# EAGLE design bldc servo controller v1 (EAGLE 9.4.2)
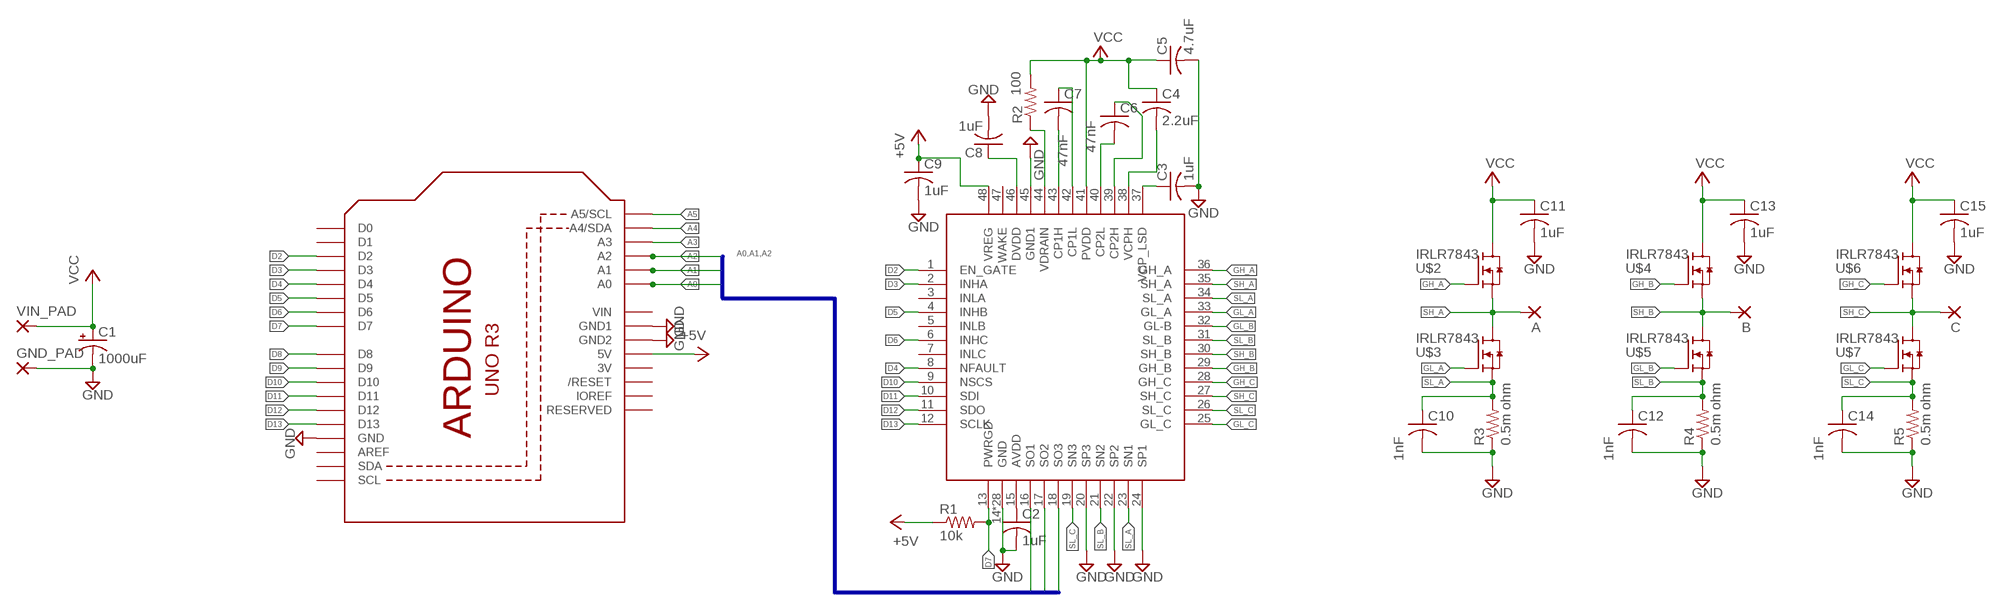
[diagram p0: schematic, sheet 1]

## Parts
A  WIREPAD1,6/0,8  [1,6/0,8]
B  WIREPAD1,6/0,8  [1,6/0,8]
C  WIREPAD1,6/0,8  [1,6/0,8]
C1  1000uF  CPOL-USE3.5-10  [E3,5-10]
C2  1uF  C-USC0805  [C0805]
C3  1uF  C-USC0805  [C0805]
C4  2.2uF  C-USC0805  [C0805]
C5  4.7uF  C-USC0805  [C0805]
C6  47nF  C-USC0805  [C0805]
C7  47nF  C-USC0805  [C0805]
C8  1uF  C-USC0805  [C0805]
C9  1uF  C-USC0805  [C0805]
C10  1nF  C-USC0805  [C0805]
C11  1uF  C-USC0805  [C0805]
C12  1nF  C-USC0805  [C0805]
C13  1uF  C-USC0805  [C0805]
C14  1nF  C-USC0805  [C0805]
C15  1uF  C-USC0805  [C0805]
GND_PAD  WIREPAD1,6/0,8  [1,6/0,8]
R1  10k  R-US_M0805  [M0805]
R2  100  R-US_M0805  [M0805]
R3  0.5m ohm  R-US_R2512  [R2512]
R4  0.5m ohm  R-US_R2512  [R2512]
R5  0.5m ohm  R-US_R2512  [R2512]
U1  ARDUINOR3-BPLACE  [ARDUINOR3-BPLACE]
U$1  DRV8305  [PFB_S-PQFP-G48]
U$2  IRLR7843  [TO252]
U$3  IRLR7843  [TO252]
U$4  IRLR7843  [TO252]
U$5  IRLR7843  [TO252]
U$6  IRLR7843  [TO252]
U$7  IRLR7843  [TO252]
VIN_PAD  WIREPAD1,6/0,8  [1,6/0,8]

## Nets
+5V: C9.1 R1.1 U1.5V U$1.48(VREG)
A0: U1.A0 U$1.16(SO1)
A1: U1.A1 U$1.17(SO2)
A2: U1.A2 U$1.18(SO3)
A3: U1.A3
A4: U1.A4(A4/SDA)
A5: U1.A5(A5/SCL)
D2: U1.D2 U$1.1(EN_GATE)
D3: U1.D3 U$1.2(INHA)
D4: U1.D4 U$1.8(NFAULT)
D5: U1.D5 U$1.4(INHB)
D6: U1.D6 U$1.6(INHC)
D7: R1.2 U1.D7 U$1.13(PWRGD)
D8: U1.D8
D9: U1.D9
D10: U1.D10 U$1.9(NSCS)
D11: U1.D11 U$1.10(SDI)
D12: U1.D12 U$1.11(SDO)
D13: U1.D13 U$1.12(SCLK)
GH_A: U$1.36(GH_A) U$2.1(G)
GH_B: U$1.29(GH_B) U$4.1(G)
GH_C: U$1.28(GH_C) U$6.1(G)
GL_A: U$1.33(GL_A) U$3.1(G)
GL_B: U$1.32(GL-B) U$5.1(G)
GL_C: U$1.25(GL_C) U$7.1(G)
GND: C1.- C2.2 C3.2 C5.2 C8.2 C9.2 C10.2 C11.2 C12.2 C13.2 C14.2 C15.2 GND_PAD.1(P) R3.1 R4.1 R5.1 U1.GND U1.GND1 U1.GND2 U$1.14(GND) U$1.20(SP3) U$1.22(SP2) U$1.24(SP1) U$1.45(GND1) U$1.P$1(GND) U$1.P$2(GND) U$1.P$3(GND) U$1.P$4(GND) U$1.P$5(GND) U$1.P$6(GND) U$1.P$7(GND) U$1.P$8(GND) U$1.P$9(GND) U$1.P$10(GND) U$1.P$11(GND) U$1.P$12(GND) U$1.P$13(GND) U$1.P$14(GND) U$1.P$15(GND) U$1.P$16(GND) U$1.P$17(GND) U$1.P$18(GND) U$1.P$19(GND) U$1.P$20(GND) U$1.P$21(GND) U$1.P$22(GND) U$1.P$23(GND) U$1.P$24(GND) U$1.P$25(GND) U$1.P$26(GND) U$1.P$27(GND)
N$1: C2.1 U$1.15(AVDD)
N$2: C3.1 U$1.37(VCP_LSD)
N$3: C4.2 U$1.38(VCPH)
N$4: C6.2 U$1.40(CP2L)
N$5: C6.1 U$1.39(CP2H)
N$6: C7.2 U$1.43(CP1H)
N$7: C7.1 U$1.42(CP1L)
N$8: R2.1 U$1.44(VDRAIN)
N$9: C8.1 U$1.46(DVDD)
SH_A: A.1(P) U$1.35(SH_A) U$2.2(S) U$3.3(D)
SH_B: B.1(P) U$1.30(SH_B) U$4.2(S) U$5.3(D)
SH_C: C.1(P) U$1.27(SH_C) U$6.2(S) U$7.3(D)
SL_A: C10.1 R3.2 U$1.23(SN1) U$1.34(SL_A) U$3.2(S)
SL_B: C12.1 R4.2 U$1.21(SN2) U$1.31(SL_B) U$5.2(S)
SL_C: C14.1 R5.2 U$1.19(SN3) U$1.26(SL_C) U$7.2(S)
VCC: C1.+ C4.1 C5.1 C11.1 C13.1 C15.1 R2.2 U$1.41(PVDD) U$2.3(D) U$4.3(D) U$6.3(D) VIN_PAD.1(P)
Unconnected: U1.AREF U1.D0 U1.D1 U1.IOREF U1.RESERVED U1.RESET(/RESET) U1.SCL U1.SDA U$1.3(INLA) U$1.5(INLB) U$1.7(INLC) U$1.47(WAKE)

## Buses
A0,A1,A2

## Power pins joined to a net without a drawn wire
3V: U1.3V
VIN: U1.VIN

## Library data of the parts
A B C GND_PAD VIN_PAD = wirepad:WIREPAD: Wire PAD connect wire on PCB
C1 = rcl:CPOL-US: POLARIZED CAPACITOR, American symbol; SPICEPREFIX: C
C2-C15 = rcl:C-US: CAPACITOR, American symbol; SPICEPREFIX: C
R1-R5 = rcl:R-US_: RESISTOR, American symbol; SPICEPREFIX: R
U1 = adafruit:ARDUINOR3: This is a new object for the new Arduino R3 - with extra pins that you may want to use (such as IOref, and duplicated A4/A5
U$1 = BLDC project:DRV8305
U$2-U$7 = BLDC project:IRLR7843

## Board
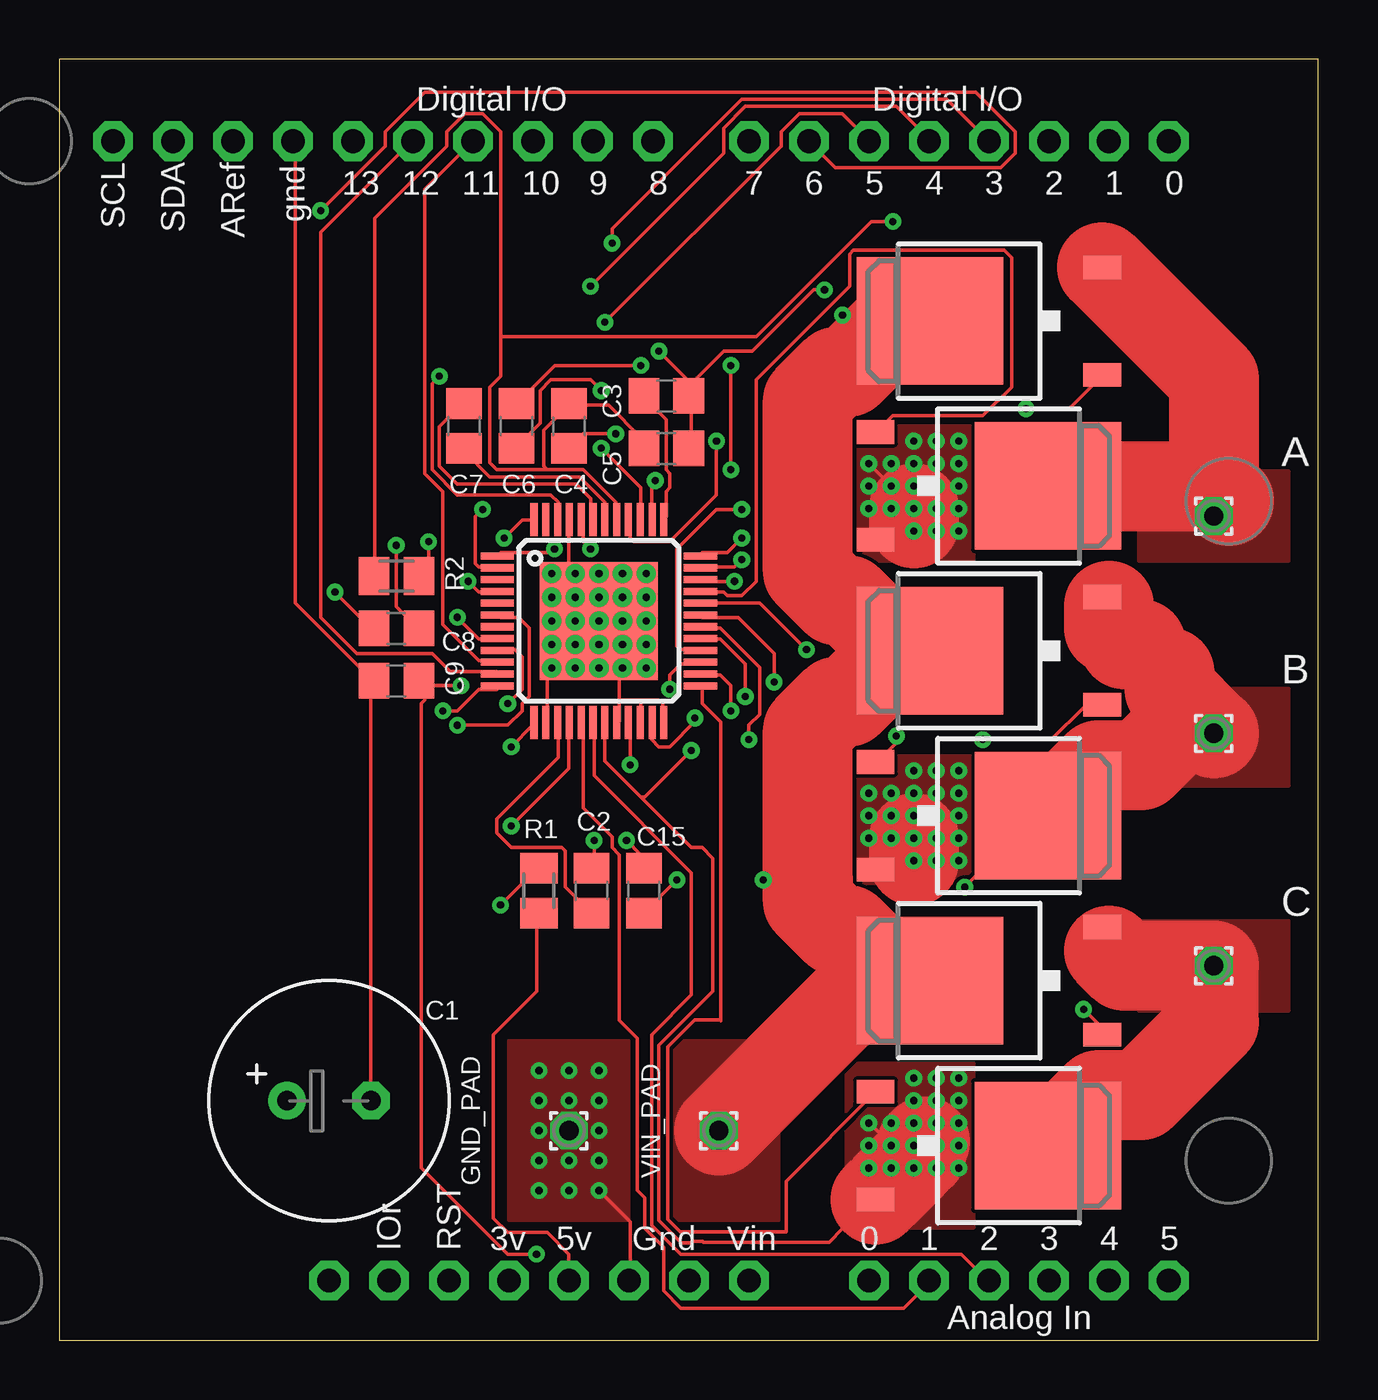
[diagram p1: board, top side]
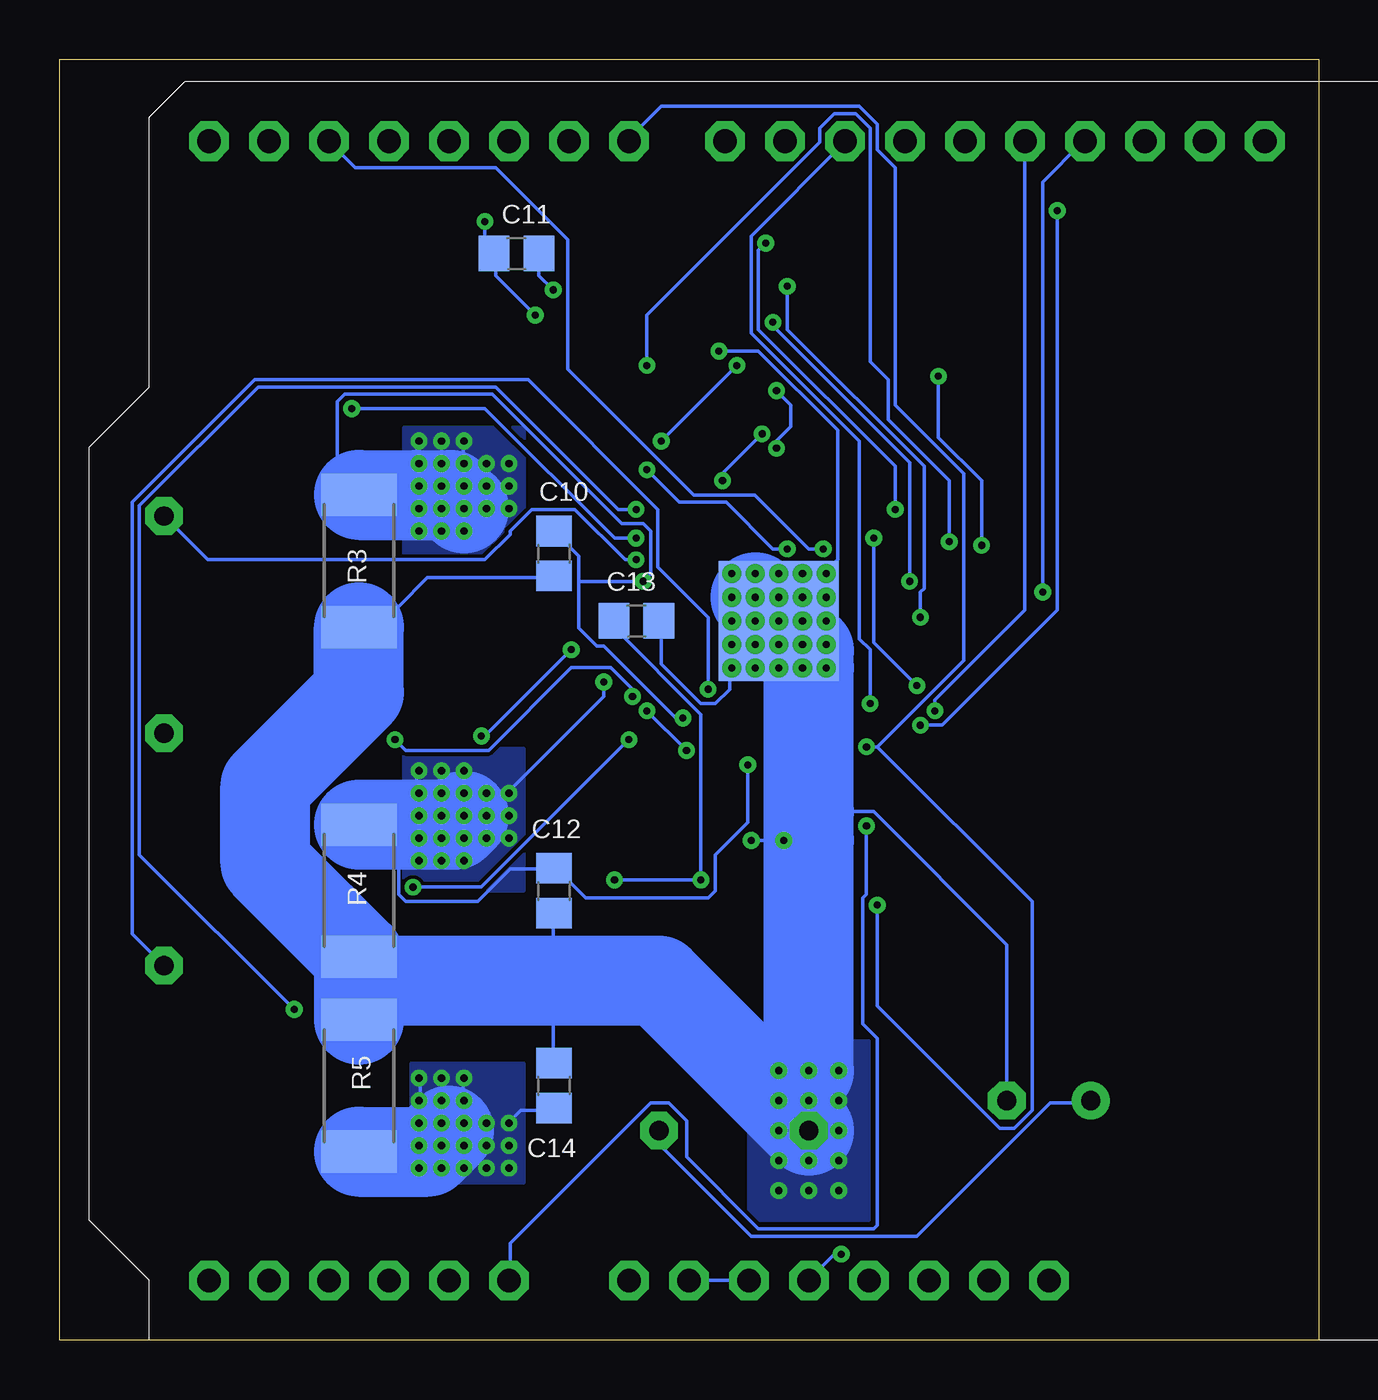
[diagram p2: board, bottom side, seen from below]

Size 53.32 x 54.28 mm. Coordinates in mm from the lower left corner, seen from the top.
Outline: 0,0 53.32,0 53.32,54.28 0,54.28 0,0
Copper layers (1*16): Top 0.035mm / dielectric 1.5mm / Bottom 0.035mm
Design rules "default *": minimum track width 6mil, minimum drill 0.3mm, track to track 6mil, track to pad 6mil, pad to pad 6mil, via to via 6mil, smd to smd 6mil, copper to edge 10mil, drill to drill 6mil, minimum pad ring 10mil, minimum via ring 8mil, stop-mask expansion 4mil, vias tented up to drill 1mm, thermal gap 0mil

### Footprints (pad centres in the part's own frame; a part is rotated, then mirrored left to right if it is on the bottom)
1,6/0,8 = drill 0.813 pad 1.6 octagon: 1 0,0
E3,5-10 = drill 0.813 pad 1.6: + -1.778,0 | drill 0.813 pad 1.6 octagon: - 1.778,0
C0805 = smd 1.3 x 1.5: 1 -0.95,0; 2 0.95,0
M0805 = smd 1.3 x 1.6: 1 -0.95,0; 2 0.95,0
R2512 = smd 1.8 x 3.2: 1 -2.8,0; 2 2.8,0
ARDUINOR3-BPLACE = drill 1 pad 1.676 octagon: 3V 35.56,2.54; 5V 38.1,2.54; A0 50.8,2.54; A1 53.34,2.54; A2 55.88,2.54; A3 58.42,2.54; A4 60.96,2.54; A5 63.5,2.54; AREF 23.876,50.8; D0 63.5,50.8; D1 60.96,50.8; D2 58.42,50.8; D3 55.88,50.8; D4 53.34,50.8; D5 50.8,50.8; D6 48.26,50.8; D7 45.72,50.8; D8 41.656,50.8; D9 39.116,50.8; D10 36.576,50.8; D11 34.036,50.8; D12 31.496,50.8; D13 28.956,50.8; GND 26.416,50.8; GND1 43.18,2.54; GND2 40.64,2.54; IOREF 30.48,2.54; RESERVED 27.94,2.54; RESET 33.02,2.54; SCL 18.796,50.8; SDA 21.336,50.8; VIN 45.72,2.54
PFB_S-PQFP-G48 = smd 1.4 x 0.3: 1 -4.3,2.75; 2 -4.3,2.25; 3 -4.3,1.75; 4 -4.3,1.25; 5 -4.3,0.75; 6 -4.3,0.25; 7 -4.3,-0.25; 8 -4.3,-0.75; 9 -4.3,-1.25; 10 -4.3,-1.75; 11 -4.3,-2.25; 12 -4.3,-2.75; 25 4.3,-2.75; 26 4.3,-2.25; 27 4.3,-1.75; 28 4.3,-1.25; 29 4.3,-0.75; 30 4.3,-0.25; 31 4.3,0.25; 32 4.3,0.75; 33 4.3,1.25; 34 4.3,1.75; 35 4.3,2.25; 36 4.3,2.75 | smd 0.3 x 1.4: 13 -2.75,-4.3; 14 -2.25,-4.3; 15 -1.75,-4.3; 16 -1.25,-4.3; 17 -0.75,-4.3; 18 -0.25,-4.3; 19 0.25,-4.3; 20 0.75,-4.3; 21 1.25,-4.3; 22 1.75,-4.3; 23 2.25,-4.3; 24 2.75,-4.3; 37 2.75,4.3; 38 2.25,4.3; 39 1.75,4.3; 40 1.25,4.3; 41 0.75,4.3; 42 0.25,4.3; 43 -0.25,4.3; 44 -0.75,4.3; 45 -1.25,4.3; 46 -1.75,4.3; 47 -2.25,4.3; 48 -2.75,4.3 | smd 5 x 5: P$1 0,0 | drill 0.305: P$2 -2,2; P$3 -1,2; P$4 0,2; P$5 1,2; P$6 2,2; P$7 -2,1; P$8 -1,1; P$9 0,1; P$10 1,1; P$11 2,1; P$12 2,0; P$13 1,0; P$14 0,0; P$15 -1,0; P$16 -2,0; P$17 -2,-1; P$18 -1,-1; P$19 0,-1; P$20 1,-1; P$21 2,-1; P$22 2,-2; P$23 1,-2; P$24 0,-2; P$25 -1,-2; P$26 -2,-2 | smd 5.08 x 5.08 bottom: P$27 0,0
TO252 = smd 1 x 1.6: 1 -2.28,-4.8; 2 2.28,-4.8 | smd 5.4 x 6.2: 3 0,2.5

### Placement (x,y rotation side)
A  48.89,34.92 270 top
B  48.89,25.72 270 top
C  48.89,15.88 270 top
C1  11.43,10.16 0 top
C2  22.54,19.05 90 top
C3  25.72,40.01 0 top
C4  21.59,38.73 270 top
C5  25.72,37.78 0 top
C6  19.37,38.73 90 top
C7  17.14,38.73 90 top
C8  14.29,30.16 180 top
C9  14.29,27.94 180 top
C10  32.39,33.34 270 bottom
C11  33.97,46.04 0 bottom
C12  32.39,19.05 270 bottom
C13  28.89,30.48 0 bottom
C14  32.39,10.79 90 bottom
C15  24.76,19.05 90 top
GND_PAD  21.59,8.89 180 top
R1  20.32,19.05 90 top
R2  14.29,32.38 180 top
R3  40.64,33.02 90 bottom
R4  40.64,19.05 90 bottom
R5  40.64,10.79 270 bottom
U1  -16.51,0 0 top
U$1  22.86,30.48 0 top
U$2  39.37,43.18 90 top
U$3  39.37,36.2 270 top
U$4  39.37,29.21 90 top
U$5  39.37,22.23 270 top
U$6  39.37,15.24 90 top
U$7  39.37,8.26 270 top
VIN_PAD  27.94,8.89 180 top

### Tracks (layer width: path | path; a pad name or v marks a point on that pad's centre or on a via)
+5V  (via drill 0.3)
  Top 0.152: v18.85,33.98 19.61,34.75 20.07,34.75 U$1.48 | 15.49,27.74 v17.02,27.74 | 15.49,27.74 15.34,27.89 C9.1 15.49,27.74 | U1.5V 21.59,3.66 20.68,4.57 19,4.57 18.39,5.18 18.39,12.95 20.22,14.78 20.22,17.98 R1.1 | 15.49,27.74 15.49,27.13 15.34,26.98 15.34,7.32 19,3.66 v20.22,3.66
  Bottom 0.152: v18.85,33.98 18.85,29.57 v17.02,27.74 | v20.22,3.66 20.52,3.66 21.59,2.59 U1.5V
A0  (via drill 0.3)
  Top 0.152: v19.15,21.79 21.59,24.23 21.59,26.06 U$1.16
  Bottom 0.152: v19.15,21.79 19.15,18.9 19.3,18.75 19.3,13.41 18.69,12.8 18.69,4.88 18.85,4.72 23.72,4.72 26.77,7.77 26.77,9.3 27.53,10.06 28.3,10.06 34.24,4.12 34.24,2.59 U1.A0
A1
  Top 0.152: U$1.17 22.2,26.06 22.2,22.55 23.42,21.34 23.42,20.88 23.72,20.57 23.72,13.56 24.49,12.8 24.49,6.35 24.79,6.04 24.79,4.75 25.6,3.94 25.6,2.1 26.33,1.37 35.76,1.37 36.83,2.44 U1.A1
A2
  Top 0.152: U$1.18 22.66,26.06 22.66,23.93 26.77,19.81 26.77,14.63 25.09,12.95 25.09,4.88 26.31,3.66 38.2,3.66 39.27,2.59 U1.A2
D2  (via drill 0.3)
  Top 0.152: v20.98,33.53 20.83,33.38 18.69,33.38 U$1.1
  Bottom 0.152: v20.98,33.53 21.59,33.53 23.88,35.81 26.47,35.81 31.8,41.15 31.8,46.63 34.85,49.68 40.79,49.68 U1.D2
D3  (via drill 0.3)
  Top 0.152: v17.93,35.2 17.63,34.9 17.63,32.92 17.78,32.77 18.54,32.77 U$1.2 | v23.42,46.48 23.42,47.09 28.9,52.58 37.59,52.58 U1.D3
  Bottom 0.152: v17.93,35.2 17.93,37.03 23.72,42.82 23.72,46.18 v23.42,46.48
D4  (via drill 0.3)
  Top 0.152: v16.87,30.63 17.78,29.72 18.54,29.72 U$1.8 | v22.5,44.65 28.14,50.29 28.14,51.36 29.06,52.27 35.46,52.27 36.83,50.9 U1.D4
  Bottom 0.152: v16.87,30.63 16.87,31.7 16.71,31.85 16.71,37.03 22.5,42.82 v22.5,44.65
D5  (via drill 0.3)
  Top 0.152: v17.32,32.16 17.78,31.7 18.54,31.7 U$1.4 | v23.11,43.13 30.58,50.6 30.58,51.21 31.34,51.97 33.17,51.97 34.24,50.9 U1.D5
  Bottom 0.152: v17.32,32.16 17.32,37.19 23.11,42.98 v23.11,43.13
D6  (via drill 0.3)
  Top 0.152: v16.87,26.06 19,26.06 19.61,26.67 19.61,26.98 19.91,27.28 19.91,30.18 19.46,30.63 18.69,30.63 U$1.6 | v11.07,47.85 13.82,50.6 13.82,51.21 15.49,52.88 38.81,52.88 40.49,51.21 40.49,50.29 39.88,49.68 32.87,49.68 U1.D6
  Bottom 0.152: v16.87,26.06 15.95,26.06 11.07,30.94 v11.07,47.85
D7  (via drill 0.3)
  Top 0.152: v19.15,25.15 20.07,26.06 U$1.13 | v18.69,18.44 20.22,19.96 R1.2
  Bottom 0.152: 18.69,25.15 v19.15,25.15 | 18.69,25.15 15.04,28.8 15.04,36.73 17.93,39.62 17.93,49.68 18.69,50.44 18.69,51.51 19.46,52.27 27.84,52.27 29.21,50.9 U1.D7 | v18.69,18.44 18.69,14.17 13.51,8.99 12.9,8.99 12.14,9.75 12.14,18.59 18.69,25.15
D10  (via drill 0.3)
  Top 0.152: v19,26.98 19.61,27.58 19.61,28.96 19.3,29.26 18.69,29.26 U$1.9
  Bottom 0.152: v19,26.98 19,29.26 19.46,29.72 19.46,38.1 24.03,42.67 24.03,46.79 20.07,50.75 U1.D10
D11
  Top 0.152: U1.D11 15.49,48.77 15.49,36.73 16.26,35.97 16.26,30.33 17.78,28.8 18.54,28.8 U$1.10
D12
  Top 0.152: U$1.11 18.54,28.35 16.56,28.35 15.8,29.11 12.6,29.11 11.07,30.63 11.07,46.94 14.88,50.75 U1.D12
D13  (via drill 0.3)
  Top 0.152: v16.26,26.67 16.87,26.67 17.78,27.58 18.54,27.58 U$1.12
  Bottom 0.152: v16.26,26.67 16.26,27.13 12.45,30.94 U1.D13
GH_A  (via drill 0.3)
  Top 0.152: v28.9,33.98 28.3,33.38 27.23,33.38 U$1.36 | v40.94,39.47 42.77,39.47 44.14,40.84 U$2.1
  Bottom 0.152: v28.9,33.98 29.82,33.98 35.31,39.47 v40.94,39.47
GH_B  (via drill 0.3)
  Top 0.152: v29.06,27.28 29.06,28.65 27.99,29.72 27.23,29.72 U$1.29 | v39.12,25.45 42.01,25.45 43.38,26.82 44.14,26.82 U$4.1
  Bottom 0.152: v29.06,27.28 29.06,27.58 29.97,28.5 31.65,28.5 35.15,24.99 38.66,24.99 v39.12,25.45
GH_C  (via drill 0.3)
  Top 0.152: v28.9,35.2 27.84,35.2 26.16,33.53 26.16,29.41 26.31,29.26 27.08,29.26 U$1.28 | v43.38,14.02 44.3,13.11 U$6.1
  Bottom 0.152: v28.9,35.2 29.67,35.2 34.85,40.39 44.91,40.39 49.94,35.36 49.94,20.57 v43.38,14.02
GL_A
  Top 0.152: U$1.33 27.23,31.7 28.14,31.7 28.3,31.55 28.9,31.55 29.51,32.16 29.51,40.69 33.48,44.65 33.48,46.02 33.63,46.18 40.03,46.18 40.33,45.87 40.33,40.39 39.12,39.17 35.31,39.17 34.7,38.56 U$3.1
GL_B  (via drill 0.3)
  Top 0.152: v31.65,29.26 29.67,31.24 27.23,31.24 U$1.32 | v35.46,25.6 35.46,25.3 34.7,24.54 U$5.1
  Bottom 0.152: v31.65,29.26 35.31,25.6 v35.46,25.6
GL_C
  Top 0.152: 28.02,13.54 28.02,13.59 | 28.02,13.59 28.02,26.19 27.23,26.98 27.23,27.58 U$1.25 | 34.54,10.52 U$7.1 30.79,6.75 30.79,4.6 26.31,4.6 25.78,5.13 25.78,12.45 26.92,13.59 28.02,13.59
GND  (via drill 0.3)
  Top 0.152: v11.68,31.7 13.21,30.18 C8.2 | C1.- 13.21,27.89 C9.2 13.21,28.04 10.01,31.24 10.01,50.75 U1.GND | C5.2 26.77,37.8 26.77,39.93 C3.2 | v32.41,44.5 31.95,44.5 29.36,41.91 28.14,41.91 26.77,40.54 | 26.77,40.54 26.77,40.08 C3.2 | U$1.14 20.68,26.21 20.68,28.19 20.83,28.35 U$1.P$27 | 23.72,27.13 23.72,28.35 U$1.P$27 | 23.72,27.13 23.72,26.21 U$1.20 | 24.49,27.13 24.64,26.98 24.64,26.21 U$1.22 | 23.72,27.13 24.49,27.13 | 24.49,27.13 25.4,27.13 25.55,26.98 25.55,26.21 U$1.24 | 21.74,32.61 21.59,32.77 21.59,34.75 U$1.45 | U$1.P$18 21.89,29.57 U$1.P$27 | U$1.P$23 23.72,28.5 U$1.P$27 | 22.81,30.48 U$1.P$27 | 21.74,32.61 20.98,32.61 U$1.P$2 | 21.74,32.61 U$1.P$3 | 21.74,32.61 U$1.P$27 | v22.66,21.18 22.66,20.12 C2.2 | v24.03,21.18 24.64,20.57 24.64,20.12 C15.2 | U1.GND2 24.18,2.59 24.18,5.03 v22.86,6.35 | v25.4,41.91 26.77,40.54 | 26.77,40.54 C3.2
  Bottom 0.152: v11.68,31.7 11.68,49.07 10.01,50.75 U1.GND | v32.41,44.5 33.02,45.11 33.02,46.02 C11.2 | C13.2 27.84,30.48 27.84,28.65 26.16,26.98 25.55,26.98 24.94,27.58 24.94,28.35 U$1.P$27 | U$1.P$17 20.83,29.57 U$1.P$27 | 20.83,30.48 U$1.P$16 U$1.P$15 U$1.P$27 | U$1.P$25 21.89,28.5 U$1.P$27 | U$1.P$24 22.81,28.5 U$1.P$27 | U$1.P$19 22.81,29.57 U$1.P$27 | U$1.P$20 23.88,29.57 U$1.P$27 | U$1.P$7 20.98,31.39 21.13,31.39 U$1.P$27 | U$1.P$22 24.79,28.5 U$1.P$27 | U$1.P$21 24.79,29.57 24.64,29.57 U$1.P$27 | U$1.P$8 21.89,31.55 U$1.P$27 | U$1.P$9 22.81,31.55 U$1.P$27 | U$1.P$4 22.81,32.61 U$1.P$27 | 23.88,30.48 U$1.P$13 U$1.P$27 | 24.94,30.48 U$1.P$12 U$1.P$27 | U$1.P$5 23.88,32.61 U$1.P$27 | U$1.P$11 24.94,31.55 U$1.P$27 | 24.94,32.61 U$1.P$27 | C10.2 32.41,32.31 37.74,32.31 38.96,31.09 R3.1 | C14.2 32.41,11.89 32.41,15.24 32.41,17.98 C12.2 | 21.59,21.18 v22.66,21.18 v24.03,21.18 | U$1.P$26 20.83,28.5 21.59,28.5 | 40.64,16.31 R4.1 40.64,15.24 | 24.94,32.61 U$1.P$6 | 24.94,32.61 U$1.P$10 | v25.4,41.91 23.72,41.91 20.37,38.56 20.37,33.07 20.83,32.61 U$1.P$2 | C1.- 13.21,16.76 18.85,22.4 21.59,22.4 | U1.GND2 U1.GND1
  Bottom 3.81: GND_PAD.1 27.94,15.24 32.41,15.24 40.64,15.24 R5.1 | R4.1 42.28,17.89 44.6,20.21 44.6,23.49 40.64,27.45 R3.1 | v21.59,11.43 21.59,21.18 21.59,22.4 21.59,28.5 21.59,29.21 U$1.P$27 U$1.P$10
  other vias: 22.86,7.62 21.59,7.62 20.32,11.43 20.32,10.16 20.32,8.89 21.59,10.16 22.86,10.16 22.86,8.89 22.86,11.43 20.32,7.62 21.59,6.35 20.32,6.35
  pour Top: 19.05,5.08 19.05,12.7 24.13,12.7 24.13,5.08
  pour Bottom: 19.05,12.7 24.13,12.7 24.13,5.08 19.05,5.08
N$1
  Top 0.152: U$1.15 21.13,26.06 21.13,24.69 18.54,22.1 18.54,21.49 19.15,20.88 21.29,20.88 21.44,20.73 21.44,19.2 22.5,18.14 C2.1
N$2
  Top 0.152: U$1.37 25.71,34.9 25.71,35.97 25.86,36.12 25.86,36.73 25.71,36.88 25.71,39.01 24.79,39.93 C3.1
N$3  (via drill 0.3)
  Top 0.152: v25.25,36.42 25.09,36.27 25.09,34.9 U$1.38 | v23.57,38.41 22.2,38.41 21.59,37.8 C4.2
  Bottom 0.152: v25.25,36.42 25.25,36.73 v23.57,38.41
N$4  (via drill 0.3)
  Top 0.152: v27.84,38.1 27.84,35.81 25.86,33.83 24.33,33.83 24.18,33.98 24.18,34.75 U$1.40 | v24.64,41.3 20.98,41.3 19.46,39.78 C6.2
  Bottom 0.152: v24.64,41.3 v27.84,38.1
N$5  (via drill 0.3)
  Top 0.152: v22.96,37.8 24.64,36.12 24.64,34.9 U$1.39 | v22.96,40.23 22.5,40.69 20.83,40.69 20.37,40.23 20.37,38.86 19.3,37.8 C6.1
  Bottom 0.152: v22.96,37.8 22.96,38.1 22.35,38.71 22.35,39.62 v22.96,40.23
N$6
  Top 0.152: U$1.43 22.5,34.9 22.5,35.66 21.89,36.27 16.87,36.27 16.1,37.03 16.1,38.71 17.02,39.62 C7.2
N$7
  Top 0.152: U$1.42 23.11,34.9 23.11,35.51 22.05,36.58 18.24,36.58 17.17,37.64 C7.1
N$8  (via drill 0.3)
  Top 0.152: v22.5,33.53 22.2,33.83 22.2,34.75 U$1.44 | v28.45,41.3 v28.45,36.88 | v15.65,33.83 15.65,32.77 15.34,32.46 R2.1
  Bottom 0.152: v22.5,33.53 23.11,33.53 25.09,35.51 27.08,35.51 v28.45,36.88 | v28.45,41.3 28.45,43.43 21.13,50.75 21.13,51.36 20.52,51.97 19.61,51.97 19,51.36 19,41.45 18.24,40.69 18.24,39.01 15.65,36.42 v15.65,33.83
N$9  (via drill 0.3)
  Top 0.152: v16.1,40.84 15.8,40.54 15.8,36.88 16.87,35.81 20.83,35.81 21.13,35.51 21.13,34.9 U$1.46 | v14.27,33.68 14.27,31.09 15.19,30.18 C8.1
  Bottom 0.152: v16.1,40.84 16.1,38.25 14.27,36.42 v14.27,33.68
SH_A  (via drill 0.3)
  Top 0.152: v28.9,33.07 28.6,32.77 27.23,32.77 U$1.35 | 48.87,36.2 48.87,35.05 A.1
  Top 3.81: U$3.3 48.87,36.2 48.89,36.2 | 48.89,36.2 49.53,35.56 48.89,36.2 | U$2.2 48.89,40.73 48.89,36.2
  Bottom 0.152: v28.9,33.07 29.36,33.07 31.5,35.2 33.33,35.2 34.24,34.29 34.24,34.14 35.31,33.07 47.04,33.07 A.1
  pour Top: 45.72,36.83 52.07,36.83 52.07,33.02 45.72,33.02
SH_B  (via drill 0.3)
  Top 0.152: v29.21,25.45 29.21,26.06 29.67,26.52 29.67,28.5 27.99,30.18 27.23,30.18 U$1.30 | v38.35,19.2 40.33,21.18 U$5.3 | 44.14,31.55 U$4.2 44.45,31.21 44.45,30.16 45.12,29.49 | 47.03,28.28 45.82,29.49
  Top 3.81: U$5.3 44.02,24.37 45.82,24.37 47.17,25.72 | 44.45,31.11 44.45,30.16 | B.1 47.03,27.59 47.03,28.28 | 45.82,29.49 45.12,29.49
  Bottom 0.152: v29.21,25.45 35.46,19.2 v38.35,19.2
  pour Top: 52.07,27.62 52.07,23.5 45.72,23.5 45.72,27.62
SH_C  (via drill 0.3)
  Top 0.152: v25.86,27.58 25.86,28.19 26.31,28.65 27.08,28.65 U$1.27 | 44.14,17.53 U$6.2 45.08,16.61 45.08,15.88
  Top 3.81: U$7.3 44.02,10.4 45.82,10.4 48.89,13.47 C.1 45.08,15.88 44.45,16.51
  Bottom 0.152: v25.86,27.58 25.86,30.63 27.99,32.77 27.99,35.2 33.48,40.69 45.06,40.69 50.24,35.51 50.24,17.22 C.1
  pour Top: 52.07,17.78 52.07,13.97 45.72,13.97 45.72,17.78
SL_A  (via drill 0.3)
  Top 0.152: 37.14,34.29 v37.15,34.29 | 34.39,35.2 v34.29,35.24 | 35.31,35.2 v35.24,35.24 | 37.14,35.2 v37.15,35.24 | 34.54,36.12 34.39,36.12 v34.29,36.2 | 35.31,36.27 v35.24,36.2 | 37.14,36.27 v37.15,36.2 | 34.85,36.58 34.39,37.03 v34.29,37.15 | 34.54,33.98 U$3.2 | v26.92,26.36 26.92,26.21 25.86,25.15 25.4,25.15 25.09,25.45 25.09,26.06 U$1.23 | v28.6,32.16 27.23,32.16 U$1.34
  Top 3.81: v36.19,35.24 36.19,35.2 36.19,34.61
  Bottom 0.152: v38.1,34.29 38.2,34.29 38.2,35.2 | 38.2,35.2 38.2,35.82 38.2,37.19 | 38.2,35.2 v38.1,35.24 | 38.2,35.2 36.77,35.82 | v38.1,36.2 38.2,36.27 36.77,35.82 | v35.24,37.15 35.31,37.03 36.65,35.69 | v36.19,37.15 36.22,37.19 36.77,35.82 | v37.15,37.15 37.14,37.19 36.77,35.82 | 38.2,37.19 v38.1,37.15 | v36.19,38.1 36.22,38.1 36.22,37.64 36.77,35.82 | v37.15,38.1 37.14,38.1 37.14,37.64 36.77,35.82 | v38.1,38.1 38.2,38.1 38.2,37.19 | v26.92,26.36 27.23,26.36 30.28,29.41 30.58,29.41 31.34,30.18 31.34,32.16 | 31.34,32.16 31.34,33.22 32.26,34.14 C10.1 | 31.34,32.16 v28.6,32.16 28.3,32.46 28.3,34.29 28.6,34.59 29.51,34.59 35,40.08 41.25,40.08 41.55,39.78 41.55,37.49 R3.2
  Bottom 3.81: R3.2 38.2,35.82 36.77,35.82 36.65,35.69 v36.19,35.24
  other vias: 36.19,36.2 36.19,34.29
  pour Bottom: 33.64,38.66 38.73,38.66 38.73,33.34 33.64,33.34
  pour Top: 33.66,33.02 33.66,38.73 38.73,38.73 38.73,33.02
SL_B  (via drill 0.3)
  Top 0.152: v24.18,24.38 24.18,26.06 U$1.21 | v37.15,20.32 37.14,20.27 v36.19,20.32 | 34.39,21.34 v34.29,21.27 | v35.24,21.27 35.31,21.34 v36.19,21.27 | v37.15,21.27 37.14,21.34 v36.19,21.27 | v35.24,22.23 35.31,22.25 v36.19,21.27 | v37.15,22.23 37.14,22.25 v36.19,21.27 | 36.22,23.16 v36.19,23.18 | v30.28,27.89 30.28,29.11 28.75,30.63 27.23,30.63 U$1.31 | 34.54,19.96 U$5.2
  Top 3.81: v36.19,21.27 v36.19,20.32
  Bottom 0.152: v24.18,24.38 24.18,21.95 25.55,20.57 25.55,19.05 25.86,18.75 31.04,18.75 32.26,19.96 C12.1 32.41,19.96 34.24,19.96 35.61,18.59 38.66,18.59 38.96,18.9 38.96,21.85 | v36.19,20.32 36.22,20.27 36.57,21.85 | v34.29,22.23 34.39,22.25 v36.19,22.23 | v36.19,22.23 34.54,23.16 34.39,23.16 v34.29,23.18 34.24,23.32 30.28,27.28 v30.28,27.89 | v35.24,23.18 35.31,23.16 v36.19,22.23 | v38.1,20.32 38.2,20.27 38.2,21.34 | 38.2,21.34 38.2,21.85 38.2,23.16 | 38.2,21.34 v38.1,21.27 | 38.2,21.34 36.57,21.85 | v38.1,22.23 38.2,22.25 36.57,21.85 | v37.15,23.18 v36.19,22.23 | 38.2,23.16 v38.1,23.18 | v36.19,24.13 36.22,24.08 v36.19,22.23 | v37.15,24.13 37.14,24.08 36.98,23.93 v36.19,22.23 | v38.1,24.13 38.2,24.08 38.2,23.16
  Bottom 3.81: R4.2 38.96,21.85 38.2,21.85 36.57,21.85 v36.19,22.23
  pour Top: 33.34,24.77 33.34,19.37 38.73,19.37 38.73,24.77
  pour Bottom: 33.66,25.08 38.73,25.08 38.73,19.05 33.66,19.05
SL_C  (via drill 0.3)
  Top 0.152: v34.29,7.3 34.39,7.32 35.15,6.56 | v34.29,8.26 34.39,8.23 35.31,7.32 v35.24,7.3 | v34.29,9.21 34.39,9.14 34.7,8.84 36.51,8.27 | v35.24,8.26 35.31,8.23 36.06,7.47 36.22,7.32 v36.19,7.3 | v35.24,9.21 35.31,9.3 36.51,7.92 | v36.19,8.26 36.22,8.23 36.51,7.92 | v36.19,9.21 36.22,9.3 36.51,7.92 | v36.19,10.16 36.22,10.21 36.66,8.42 | v37.15,7.3 37.14,7.32 36.51,7.92 | 37.14,8.23 v37.15,8.26 | v37.15,9.21 37.14,9.3 36.51,7.92 | v37.15,10.16 37.14,10.21 36.66,8.42 | v38.1,7.3 38.2,7.32 36.51,7.92 | v38.1,8.26 38.2,8.23 36.51,7.92 | v38.1,9.21 38.2,9.3 36.66,8.42 | 24.64,23.01 26.77,20.88 27.23,20.88 27.69,20.42 27.69,14.78 25.4,12.5 25.4,5.08 26.35,4.13 26.73,4.13 26.8,4.19 27.25,4.19 27.28,4.17 32.61,4.17 33.17,4.72 U$7.2 | 24.64,23.01 23.11,24.54 23.11,26.06 U$1.19 | v28.45,26.67 28.45,27.74 27.99,28.19 27.23,28.19 U$1.26 | v26.77,24.99 24.79,23.01 24.64,23.01
  Top 3.81: U$7.2 35.15,6.56 36.06,7.47 36.51,7.92 36.51,8.27 36.66,8.42
  Bottom 0.152: v36.19,11.11 36.22,10.97 36.22,10.67 36.83,8.89 37.14,10.67 37.14,10.97 v37.15,11.11 | 36.86,8.87 38.2,10.21 v38.1,10.16 38.05,10.36 38.05,10.97 v38.1,11.11 | v26.77,24.99 v28.45,26.67 | C14.1 32.41,9.75 33.78,9.75 34.24,9.3 v34.29,9.21 | 37.31,8.41 37.29,8.38 v37.15,8.26
  Bottom 3.81: R5.2 37.72,8 37.31,8.41 36.86,8.87 36.83,8.89
  pour Top: 33.66,11.75 38.73,11.75 38.73,4.76 33.34,4.76 33.34,11.75
  pour Bottom: 38.42,11.75 33.66,11.75 33.66,6.99 33.66,6.67 38.42,6.67
VCC  (via drill 0.3)
  Top 0.152: 20.68,36.88 22.2,36.88 23.57,35.51 23.57,34.9 U$1.41 | 20.68,36.88 20.52,37.03 20.52,38.56 21.59,39.62 | 21.59,39.62 23.27,39.62 24.64,38.25 24.64,37.8 C5.1 | 21.59,39.62 C4.1 | 18.69,42.52 18.69,40.84 18.24,40.39 18.24,37.19 18.54,36.88 20.68,36.88 | 18.69,42.52 18.69,51.21 17.93,51.97 17.17,51.97 16.41,51.21 16.41,50.6 13.36,47.55 13.36,32.46 R2.2 | v26.16,19.51 24.79,18.14 C15.1 | v33.17,43.43 34.49,42.11 | 35.56,43.18 36.83,43.13 U$2.3 | U$6.3 35.56,15.24 | 36.83,29.26 36.86,29.23 U$4.3 35.56,29.21 | v29.82,19.51 31.71,19.51 | 18.69,42.52 29.51,42.52 34.39,47.4 v35.31,47.4
  Top 3.81: VIN_PAD.1 34.29,15.24 35.56,15.24 33.41,17.39 32.92,17.39 31.71,18.59 31.71,19.51 31.71,25.86 32.92,27.06 33.41,27.06 35.56,29.21 33.41,31.36 32.92,31.36 31.71,32.56 31.71,39.83 32.92,41.03 33.41,41.03 34.49,42.11 35.56,43.18
  Bottom 0.152: C13.1 29.82,30.48 29.82,30.18 26.16,26.52 v26.16,19.51 v29.82,19.51 | v33.17,43.43 34.85,45.11 34.85,46.02 C11.1 35,46.18 35.31,46.48 v35.31,47.4 | C1.+ 9.7,10.06 11.38,10.06 17.02,4.42 24.03,4.42 27.84,8.23 27.84,8.84 VIN_PAD.1
  pour Top: 25.4,5.08 25.4,12.7 30.48,12.7 30.48,5.08